# Altium project clock_Boar V1.1.PrjPcb
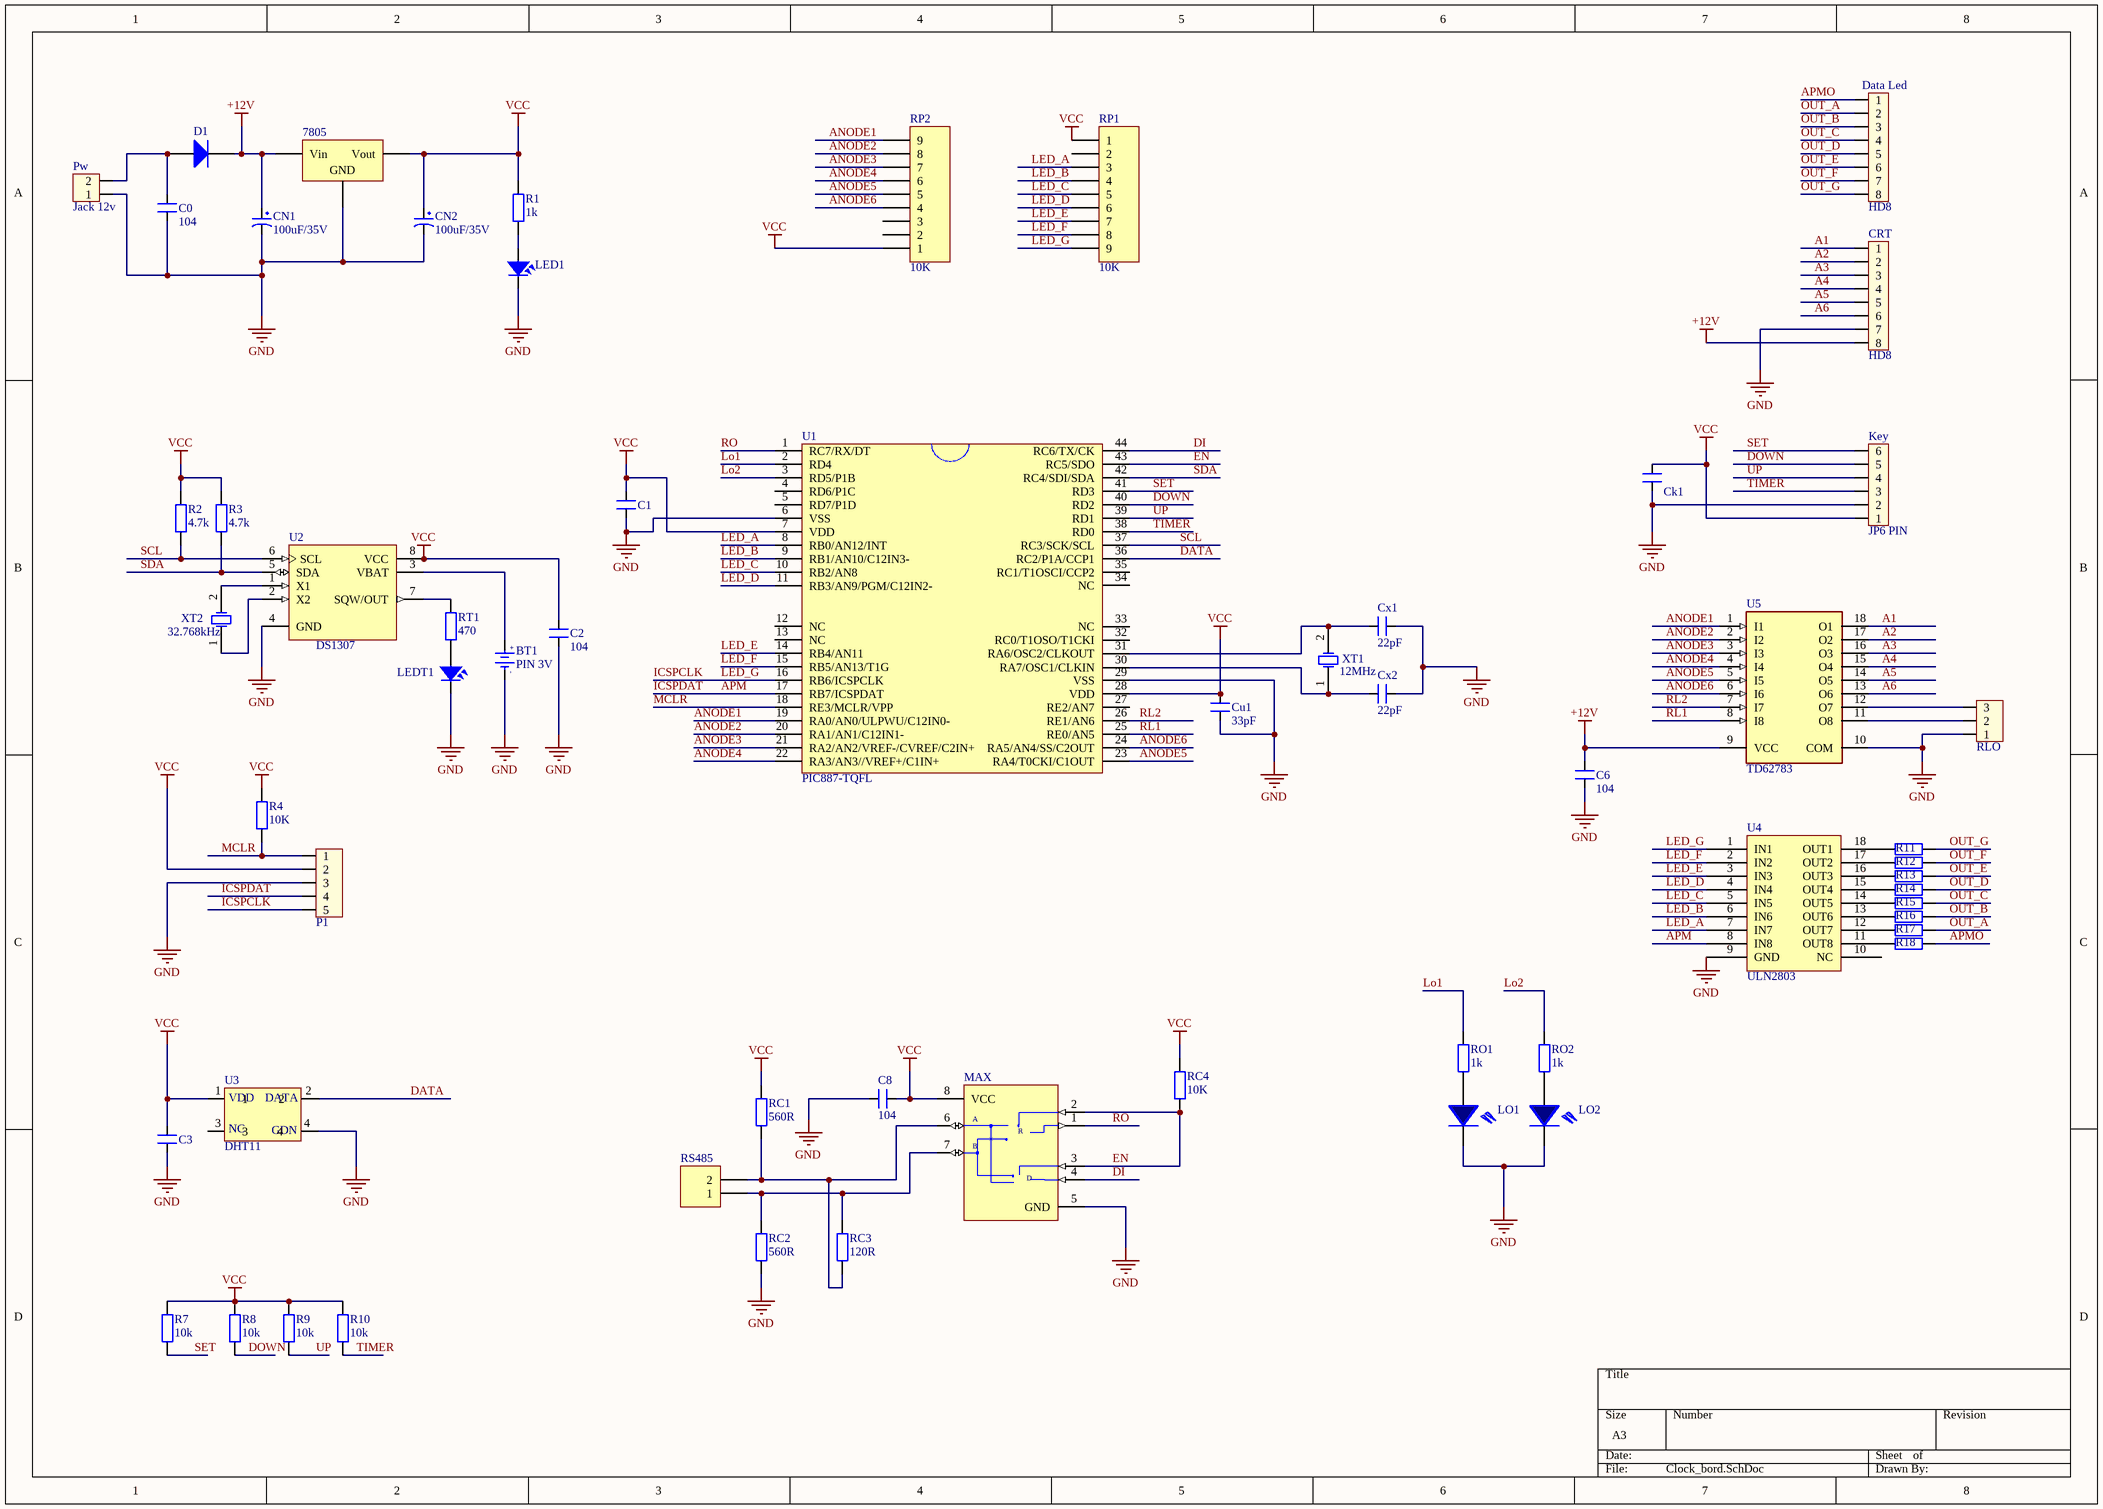
[diagram p0: Clock_bord.SchDoc]
1 sheet, 59 parts. Net scope: global (net labels, ports and power ports of the same name join across sheets).
Board file: Clock_Board v2.PcbDoc

## Sheet Clock_bord.SchDoc
size A3

### Parts
7805  Volt Reg  [TO-263]  (value not drawn)
BT1  PIN 3V  [PIN3V]
C0  104  [CN2]
C1  104  [CN1]  (value not drawn)
C2  104  [CN1]
C3  104  [CN1]  (value not drawn)
C6  104  [CN1]
C8  104  [CN1]
Ck1  100pF  [SM-1206]  (value not drawn)
CN1  100uF/35V  [CP1.5/3.4]
CN2  100uF/35V  [CP1.5/3.4]
CRT  HD8  [HED8]
Cu1  33pF  [SM-0805]
Cx1  22pF  [CN1]
Cx2  22pF  [CN1]
D1  Diode 1N4007  [D1A]  (value not drawn)
Data_Led  HD8  [HED8]
Key  JP6 PIN  [JP6]
LED1  LED  [SM-1206]  (value not drawn)
LEDT1  LED  [SM-1206]  (value not drawn)
LO1  LED  [SM-1206]  (value not drawn)
LO2  LED  [SM-1206]  (value not drawn)
MAX  MAX485CSA  [DIP8/W0.3]  (value not drawn)
P1  JP5  [CON5]  (value not drawn)
Pw  Jack 12v  [HED2]
R1  1k  [SM-1206]
R2  4.7k  [R1/4W]
R3  4.7k  [R1/4W]
R4  10K  [R1/4W]
R7  10k  [R1/4W]
R8  10k  [R1/4W]
R9  10k  [R1/4W]
R10  10k  [R1/4W]
R11  220R  [SM-1206]  (value not drawn)
R12  220R  [SM-1206]  (value not drawn)
R13  220R  [SM-1206]  (value not drawn)
R14  220R  [SM-1206]  (value not drawn)
R15  220R  [SM-1206]  (value not drawn)
R16  220R  [SM-1206]  (value not drawn)
R17  220R  [SM-1206]  (value not drawn)
R18  220R  [SM-1206]  (value not drawn)
RC1  560R  [R1/4W]
RC2  560R  [R1/4W]
RC3  120R  [SM-1206]
RC4  10K  [R1/4W]
RLO  JP3  [CON3]  (value not drawn)
RO1  1k  [SM-1206]
RO2  1k  [SM-1206]
RP1  10K  [RN8]
RP2  10K  [RN8]
RS485  Header 2  [CON2]  (value not drawn)
RT1  470  [SM-1206]
U1  PIC887-TQFL  [TQFP-44]
U2  DS1307  [DIP8/W0.3]
U3  DHT11  [CON4]
U4  ULN2803  [ULN2803]
U5  TD62783  [ULN2803]
XT1  12MHz  [Xtal_SMD]
XT2  32.768kHz  [tu_gom]

### Nets
+12V: 7805.1(Vin) C6.2 CN1.1 CRT.8 D1.2(K) U5.9(VCC)
GND: 7805.2(GND) BT1.2(GND) C0.1 C1.1 C2.1 C3.1 C6.1 C8.1 Ck1.1 CN1.2 CN2.2 CRT.7 Cu1.1 Cx1.2 Cx2.2 Key.2 LED1.2 LEDT1.2 LO1.2 LO2.2 MAX.5(GND) P1.3 Pw.1 RC2.1 RLO.1 U1.6(VSS) U1.29(VSS) U2.4(GND) U3.4 U4.9(GND) U5.10(COM)
VCC: 7805.3(Vout) C1.2 C2.2 C3.2 C8.2 Ck1.2 CN2.1 Cu1.2 Key.1 MAX.8(VCC) P1.2 R1.2 R2.2 R3.2 R4.2 R7.2 R8.2 R9.2 R10.2 RC1.2 RC4.2 RP1.1 RP2.1 U1.7(VDD) U1.28(VDD) U2.8(VCC) U3.1
A1: CRT.1 U5.18(O1)
A2: CRT.2 U5.17(O2)
A3: CRT.3 U5.16(O3)
A4: CRT.4 U5.15(O4)
A5: CRT.5 U5.14(O5)
A6: CRT.6 U5.13(O6)
ANODE1: RP2.9 U1.19(RA0/AN0/ULPWU/C12IN0-) U5.1(I1)
ANODE2: RP2.8 U1.20(RA1/AN1/C12IN1-) U5.2(I2)
ANODE3: RP2.7 U1.21(RA2/AN2/VREF-/CVREF/C2IN+) U5.3(I3)
ANODE4: RP2.6 U1.22(RA3/AN3//VREF+/C1IN+) U5.4(I4)
ANODE5: RP2.5 U1.23(RA4/T0CKI/C1OUT) U5.5(I5)
ANODE6: RP2.4 U1.24(RA5/AN4/SS/C2OUT) U5.6(I6)
APM: P1.4 U1.17(RB7/ICSPDAT) U4.8(IN8)  [also labelled ICSPDAT]
APMO: Data_Led.1 R18.2
DATA: U1.36(RC2/P1A/CCP1) U3.2
DI: MAX.4(DI) U1.44(RC6/TX/CK)
DOWN: Key.5 R8.1 U1.40(RD2)
EN: MAX.2(~{RE}) MAX.3(DE) RC4.1 U1.43(RC5/SDO)
ICSPCLK: P1.5 RP1.9 U1.16(RB6/ICSPCLK) U4.1(IN1)  [also labelled LED_G]
LED_A: RP1.3 U1.8(RB0/AN12/INT) U4.7(IN7)
LED_B: RP1.4 U1.9(RB1/AN10/C12IN3-) U4.6(IN6)
LED_C: RP1.5 U1.10(RB2/AN8) U4.5(IN5)
LED_D: RP1.6 U1.11(RB3/AN9/PGM/C12IN2-) U4.4(IN4)
LED_E: RP1.7 U1.14(RB4/AN11) U4.3(IN3)
LED_F: RP1.8 U1.15(RB5/AN13/T1G) U4.2(IN2)
Lo1: RO1.1 U1.2(RD4)
Lo2: RO2.1 U1.3(RD5/P1B)
MCLR: P1.1 R4.1 U1.18(RE3/MCLR/VPP)
OUT_A: Data_Led.2 R17.2
OUT_B: Data_Led.3 R16.2
OUT_C: Data_Led.4 R15.2
OUT_D: Data_Led.5 R14.2
OUT_E: Data_Led.6 R13.2
OUT_F: Data_Led.7 R12.2
OUT_G: Data_Led.8 R11.2
RL1: U1.25(RE0/AN5) U5.8(I8)
RL2: U1.26(RE1/AN6) U5.7(I7)
RO: MAX.1(RO) U1.1(RC7/RX/DT)
SCL: R2.1 U1.37(RC3/SCK/SCL) U2.6(SCL)
SDA: R3.1 U1.42(RC4/SDI/SDA) U2.5(SDA)
SET: Key.6 R7.1 U1.41(RD3)
TIMER: Key.3 R10.1 U1.38(RD0)
UP: Key.4 R9.1 U1.39(RD1)
NetBT1_1: BT1.1(+3V) U2.3(VBAT)
NetC0_2: C0.2 D1.1(A) Pw.2
NetCx1_1: Cx1.1 U1.31(RA6/OSC2/CLKOUT) XT1.2(OSC2)
NetCx2_1: Cx2.1 U1.30(RA7/OSC1/CLKIN) XT1.1(OSC1)
NetLED1_1: LED1.1 R1.1
NetLEDT1_1: LEDT1.1 RT1.1
NetLO1_1: LO1.1 RO1.2
NetLO2_1: LO2.1 RO2.2
NetMAX_6: MAX.6(A) RC1.1 RC3.1 RS485.2
NetMAX_7: MAX.7(B) RC2.2 RC3.2 RS485.1
NetR11_1: R11.1 U4.18(OUT1)
NetR12_1: R12.1 U4.17(OUT2)
NetR13_1: R13.1 U4.16(OUT3)
NetR14_1: R14.1 U4.15(OUT4)
NetR15_1: R15.1 U4.14(OUT5)
NetR16_1: R16.1 U4.13(OUT6)
NetR17_1: R17.1 U4.12(OUT7)
NetR18_1: R18.1 U4.11(OUT8)
NetRLO_2: RLO.2 U5.11(O8)
NetRLO_3: RLO.3 U5.12(O7)
NetRT1_2: RT1.2 U2.7(SQW/OUT)
NetU2_1: U2.1(X1) XT2.2(OSC2)
NetU2_2: U2.2(X2) XT2.1(OSC1)

Not connected (* = marked no-connect by the designer): RP1 2; RP2 2 3; U1 4(RD6/P1C) 5(RD7/P1D) 12(NC) 13(NC) 27(RE2/AN7) 32(RC0/T1OSO/T1CKI) 33(NC) 34(NC) 35(RC1/T1OSCI/CCP2); U3 3; U4 10(NC)

### Notes on the sheet
- (in symbol DHT11) VDD; DATA; NC; GDN
- (in symbol MAX485CSA) R; D
- (in symbol PIN 3V) +; -

### Library data of the parts
7805 = Volt Reg: Voltage Regulator; Published: 24-Mar-1999; LatestRevisionDate: 29-May-2009; LatestRevisionNote: IPC-7351 Footprint Added.; PackageReference: D2PAK; Publisher: Altium Limited; PackageDescription: 3-Pin Transistor Outline Package 2.54 mm Pitch, 15.1 mm Lead Span
BT1 = PIN 3V: Battery 3VDC; Value: PIN 3V
C0-C3 C6 = CN2: Cap np 104 => 105pF; Value: 0.1uF; Description: Cap np Cremic Value  104pF => 105pF
C8 = CN1: Cap np  1pF - 472pF; Value: 100pF; Description: Cap np Cremic Value  1pF => 472 pF
Ck1 = CN1: Cap np  1pF - 472pF; Description: Cap np Cremic Value  1pF => 472 pF; Value: 100pF
CN1 CN2 = CP3: Cap 100uF/35V - 470uF/16V; Value: 100uF/35V/50V; Description 1: 1000uF/6,3V - 470uF/16V - 330uF - 25V; Description 2: 220uF/35V - 100uF/50V - 63V - 4,7uF/200V; Description 3: 22uF => 33uF100V - 3,3uF => 4,7uF/250V; Description 4: 2,2uF =>3,3uF/350 - 2,2uF/400V - 1uF/450V
CRT Data_Led = Hed8: Hedear 8; Creat by: VanDungEvn@Gmail.com
Cu1 = CN0: Cremic For Xtal 1pF => 100pF; Description: Cap np Cremic value 1pF => 100pF; Value: 33pF
Cx1 Cx2 = CN0: Cremic For Xtal 1pF => 100pF; Value: 33pF; Description: Cap np Cremic value 1pF => 100pF
D1 = Diode 1N4007: 1 Amp General Purpose Rectifier; Published: 8-Jun-2000; LatestRevisionDate: 17-Jul-2002; LatestRevisionNote: Re-released for DXP Platform.; DatasheetVersion: 1998; PackageVersion: Aug-1999; PackageReference: DO-41; Publisher: Altium Limited; Code_JEDEC: DO-204-AL; ComponentLink1Description: Manufacturer Link; ComponentLink1URL: http://www.fairchildsemi.com/; ComponentLink2Description: Datasheet; ComponentLink2URL: http://www.fairchildsemi.com/ds/1N%2F1N4001.pdf
Key = JP6: Value: JP7
LED1 LEDT1 LO1 LO2 = LED: LED Single colour Green and Red; Value: LED 3 ly Single Colour; Description: LED 5 ly Single Colour; Description: Led  Vuong
MAX = MAX485CSA: Low-Power, Slew-Rate-Limited RS-485/RS-422 Transceiver; Published: 16-Jan-2001; LatestRevisionDate: 13-Apr-2006; LatestRevisionNote: IPC-7351 Footprint Added.; DatasheetVersion: Feb-1996; PackageReference: NSO8; Publisher: Altium Limited; PackageDescription: 8-Pin Small Outline Integrated Circuit 1.27 mm Pitch; Code_JEDEC: MS-012-AA; Code_IPC: SOIC127P600-8; ComponentLink1Description: Manufacturer Link; ComponentLink1URL: http://www.maxim-ic.com/; ComponentLink2Description: Datasheet; ComponentLink2URL: http://pdfserv.maxim-ic.com/en/ds/MAX1487-MAX491.pdf
P1 = Con5: Connector 5; Value: Connector 5
Pw = Hed2: Header 2 (Green); Value: Header 2
R1-R4 R7-R18 RC1-RC4 RO1 RO2 RT1 = R1/4W: Resistor 1/4W; Value: R1/4W - 1K
RLO = Con3: Connector 3; Value: Connector 3
RP1 RP2 = Header 9: Header, 9-Pin; LatestRevisionDate: 17-Jul-2002; LatestRevisionNote: Re-released for DXP Platform.; Publisher: Altium Limited
RS485 = Header 2: Header, 2-Pin; LatestRevisionDate: 17-Jul-2002; LatestRevisionNote: Re-released for DXP Platform.; Publisher: Altium Limited
U1 = PIC16F887-TQFL: 16F887_TQFP
U2 = DS1307: 64 X 8 Serial Real-Time Clock; Published: 13-Oct-2000; LatestRevisionDate: 06-Jun-2005; LatestRevisionNote: Stylized 3D Model Added.; DatasheetVersion: 10-Aug-1999; PackageVersion: 1999; PackageReference: DIP8; Publisher: Altium Limited; PackageDescription: DIP; 8 Leads; Row Spacing 7.62 mm; Pitch 2.54 mm; ComponentLink1Description: Manufacturer Link; ComponentLink1URL: http://www.maxim-ic.com/; ComponentLink2Description: Datasheet; ComponentLink2URL: http://pdfserv.maxim-ic.com/en/ds/DS1307.pdf; ComponentLink3Description: Discontinuation Notice; ComponentLink3URL: http://www.maxim-ic.com/qa/pdfs/non-obsolescence-letter.pdf
U3 = DHT11: Sensor Ther
U4 = ULN 2803
U5 = TD62783AF
XT1 XT2 = XTAL: Crystal Oscillator; Published: 8-Jun-2000; LatestRevisionDate: 17-Jul-2002; LatestRevisionNote: Re-released for DXP Platform.; PackageReference: R38; Publisher: Altium Limited